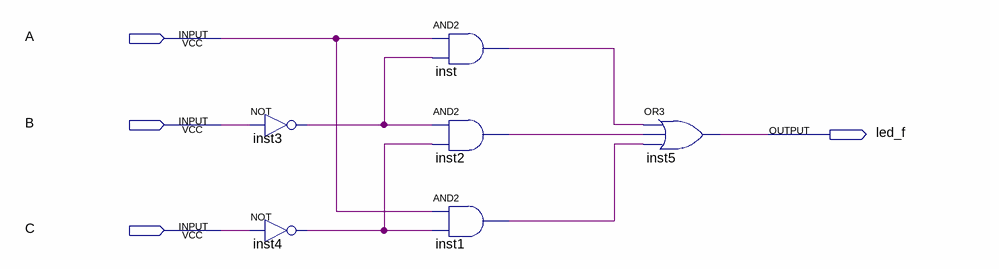
[diagram p0: schematic sheet]
// Quartus schematic led_f.bdf as structural Verilog: 6 symbols, 4 pins
module led_f (
  input  A,
  input  B,
  input  C,
  output led_f
);

  wire inst1_out, inst2_out, inst3_out, inst4_out, inst_out;

  not inst3 (inst3_out, B);
  not inst4 (inst4_out, C);
  and inst (inst_out, A, inst3_out);
  and inst2 (inst2_out, inst3_out, inst4_out);
  and inst1 (inst1_out, A, inst4_out);
  or inst5 (led_f, inst_out, inst2_out, inst1_out);
endmodule
